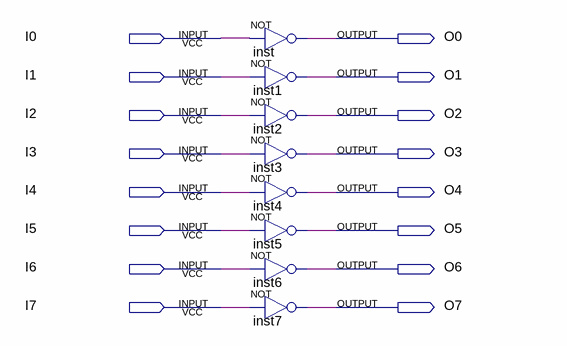
[diagram p0: schematic sheet]
// Quartus schematic not-8.bdf as structural Verilog: 8 symbols, 16 pins
module \not-8  (
  input  I0,
  input  I1,
  input  I2,
  input  I3,
  input  I4,
  input  I5,
  input  I6,
  input  I7,
  output O0,
  output O1,
  output O2,
  output O3,
  output O4,
  output O5,
  output O6,
  output O7
);

  not inst (O0, I0);
  not inst1 (O1, I1);
  not inst2 (O2, I2);
  not inst3 (O3, I3);
  not inst4 (O4, I4);
  not inst5 (O5, I5);
  not inst6 (O6, I6);
  not inst7 (O7, I7);
endmodule
